# Altium schematic sheet UCN LV.SchDoc
size A3; Revision: 7
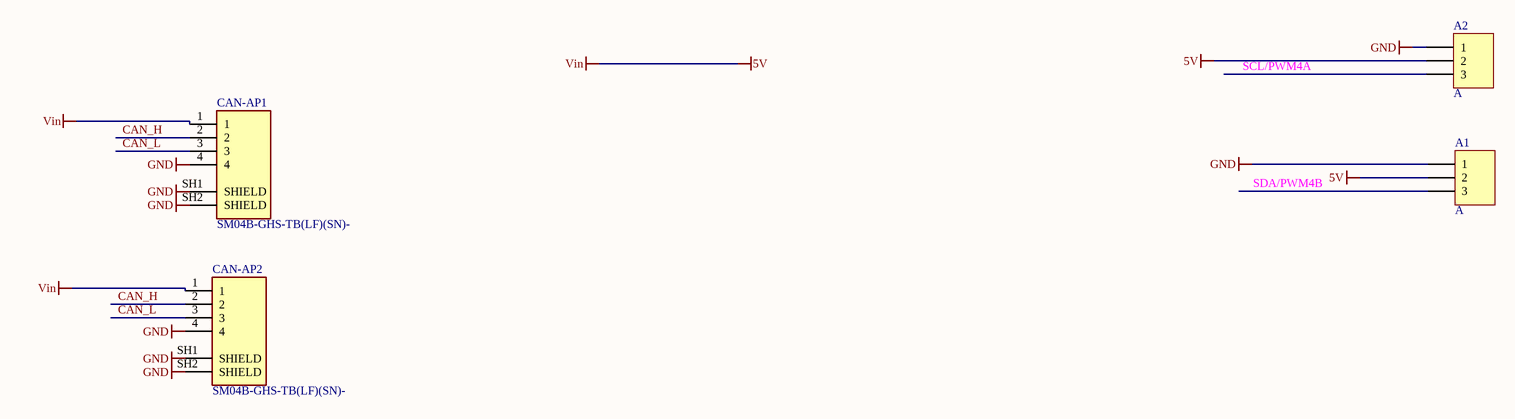
[diagram p0: UCN LV.SchDoc]

## Parts
A1  A  [HDR Side 3 pin]
A2  A  [HDR Side 3 pin]
CAN-AP1  SM04B-GHS-TB(LF)(SN)-  [JST_SM04B-GHS-TB(LF)(SN)-]
CAN-AP2  SM04B-GHS-TB(LF)(SN)-  [JST_SM04B-GHS-TB(LF)(SN)-]

## Nets
5V: A1.2 A2.2 CAN-AP1.1 CAN-AP2.1  [also labelled Vin]
GND: A1.1 A2.1 CAN-AP1.4 CAN-AP1.SH1(SHIELD) CAN-AP1.SH2(SHIELD) CAN-AP2.4 CAN-AP2.SH1(SHIELD) CAN-AP2.SH2(SHIELD)
CAN_H: CAN-AP1.2 CAN-AP2.2
CAN_L: CAN-AP1.3 CAN-AP2.3
SCL/PWM4A: A2.3
SDA/PWM4B: A1.3

## Library data of the parts
A1 A2 = Header 3: Header, 4-Pin; System: Connector; MF: Connfly electronic (Zhenqin); MP: PLS-3 (DS1021-1x3); Type: SMD; ChipDip_Link: https://www.chipdip.ru/product/pls-3; HelpURL: https://static.chipdip.ru/lib/227/DOC000227157.pdf
CAN-AP1 CAN-AP2 = SM04B-GHS-TB(LF)(SN)-: Connector Header Surface Mount, Right Angle 4 position 0.049 _1.25mm_; MF: JST Sales; MP: SM04B-GHS-TB(LF)(SN); Package: None; Value: *; SnapEDA_Link: https://www.snapeda.com/parts/SM04B-GHS-TB%28LF%29%28SN%29-/JST%20Sales%20America%20Inc./view-part/2759740/?ref=snap; HelpURL: http://www.farnell.com/datasheets/2082975.pdf; System: Connector; ChipDip_Link: https://www.chipdip.ru/product/sm04b-ghs-tb-lf-sn-gh-1.25mm-header-side-ent